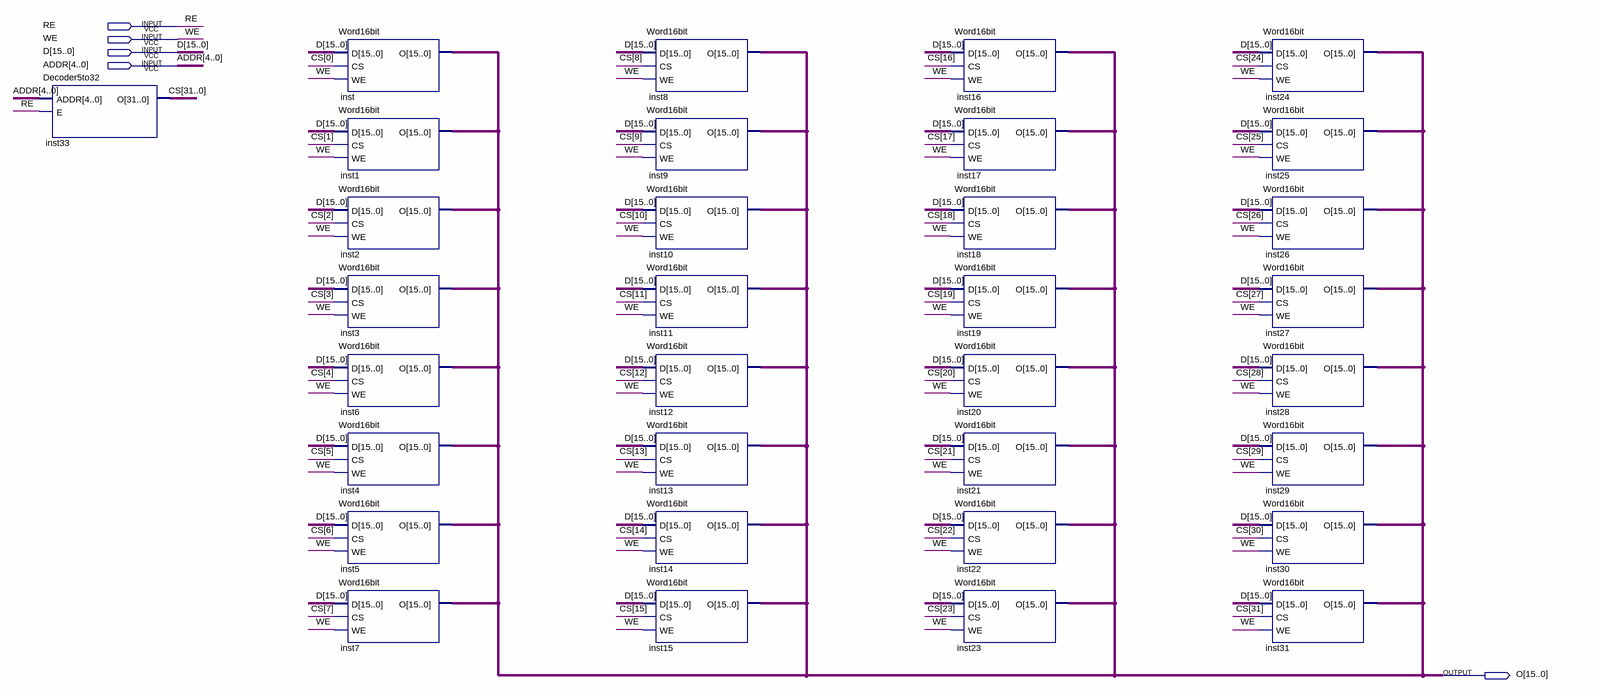
[diagram p0: schematic sheet]
// Quartus schematic DMem.bdf as structural Verilog: 33 symbols, 5 pins
module DMem (
  input  RE,
  input  WE,
  input  [15:0] D,
  input  [4:0] ADDR,
  output [15:0] O
);

  wire [31:0] CS;

  Decoder5to32 inst33 (.ADDR(ADDR), .E(RE), .O(CS));
  Word16bit inst (.D(D), .CS(CS[0]), .WE(WE), .O(O));
  Word16bit inst1 (.D(D), .CS(CS[1]), .WE(WE), .O(O));
  Word16bit inst2 (.D(D), .CS(CS[2]), .WE(WE), .O(O));
  Word16bit inst3 (.D(D), .CS(CS[3]), .WE(WE), .O(O));
  Word16bit inst6 (.D(D), .CS(CS[4]), .WE(WE), .O(O));
  Word16bit inst4 (.D(D), .CS(CS[5]), .WE(WE), .O(O));
  Word16bit inst5 (.D(D), .CS(CS[6]), .WE(WE), .O(O));
  Word16bit inst7 (.D(D), .CS(CS[7]), .WE(WE), .O(O));
  Word16bit inst8 (.D(D), .CS(CS[8]), .WE(WE), .O(O));
  Word16bit inst9 (.D(D), .CS(CS[9]), .WE(WE), .O(O));
  Word16bit inst10 (.D(D), .CS(CS[10]), .WE(WE), .O(O));
  Word16bit inst11 (.D(D), .CS(CS[11]), .WE(WE), .O(O));
  Word16bit inst12 (.D(D), .CS(CS[12]), .WE(WE), .O(O));
  Word16bit inst13 (.D(D), .CS(CS[13]), .WE(WE), .O(O));
  Word16bit inst14 (.D(D), .CS(CS[14]), .WE(WE), .O(O));
  Word16bit inst15 (.D(D), .CS(CS[15]), .WE(WE), .O(O));
  Word16bit inst16 (.D(D), .CS(CS[16]), .WE(WE), .O(O));
  Word16bit inst17 (.D(D), .CS(CS[17]), .WE(WE), .O(O));
  Word16bit inst18 (.D(D), .CS(CS[18]), .WE(WE), .O(O));
  Word16bit inst19 (.D(D), .CS(CS[19]), .WE(WE), .O(O));
  Word16bit inst20 (.D(D), .CS(CS[20]), .WE(WE), .O(O));
  Word16bit inst21 (.D(D), .CS(CS[21]), .WE(WE), .O(O));
  Word16bit inst22 (.D(D), .CS(CS[22]), .WE(WE), .O(O));
  Word16bit inst23 (.D(D), .CS(CS[23]), .WE(WE), .O(O));
  Word16bit inst24 (.D(D), .CS(CS[24]), .WE(WE), .O(O));
  Word16bit inst25 (.D(D), .CS(CS[25]), .WE(WE), .O(O));
  Word16bit inst26 (.D(D), .CS(CS[26]), .WE(WE), .O(O));
  Word16bit inst27 (.D(D), .CS(CS[27]), .WE(WE), .O(O));
  Word16bit inst28 (.D(D), .CS(CS[28]), .WE(WE), .O(O));
  Word16bit inst29 (.D(D), .CS(CS[29]), .WE(WE), .O(O));
  Word16bit inst30 (.D(D), .CS(CS[30]), .WE(WE), .O(O));
  Word16bit inst31 (.D(D), .CS(CS[31]), .WE(WE), .O(O));
endmodule
